# Altium schematic sheet Power.SchDoc
size A4
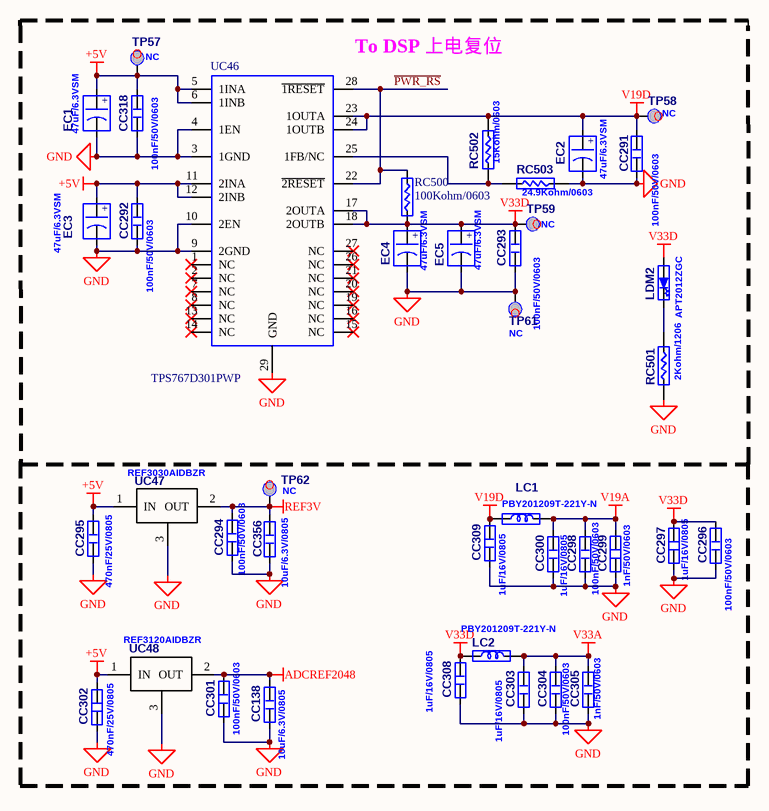
[diagram p0: Power.SchDoc]

## Parts
CC138  value 10uF/6.3V/0805  [CC2012-0805]  (hidden comment: 023-106330-0)
CC291  value 100nF/50V/0603  [CC1608-0603]  (hidden comment: 023-105220-0)
CC292  value 100nF/50V/0603  [CC1608-0603]  (hidden comment: 023-105220-0)
CC293  value 100nF/50V/0603  [CC1608-0603]  (hidden comment: 023-105220-0)
CC294  value 100nF/50V/0603  [CC1608-0603]  (hidden comment: 023-105220-0)
CC295  value 470nF/25V/0805  [CC2012-0805]  (hidden comment: 023-474250-0)
CC296  value 100nF/50V/0603  [CC1608-0603]  (hidden comment: 023-105220-0)
CC297  value 1uF/16V/0805  [CC2012-0805]  (hidden comment: 023-105330-0)
CC298  value 100nF/50V/0603  [CC1608-0603]  (hidden comment: 023-105220-0)
CC299  value 1nF/50V/0603  [CC1608-0603]  (hidden comment: 023-102220-0)
CC300  value 1uF/16V/0805  [CC2012-0805]  (hidden comment: 023-105330-0)
CC301  value 100nF/50V/0603  [CC1608-0603]  (hidden comment: 023-105220-0)
CC302  value 470nF/25V/0805  [CC2012-0805]  (hidden comment: 023-474250-0)
CC303  value 1uF/16V/0805  [CC2012-0805]  (hidden comment: 023-105330-0)
CC304  value 100nF/50V/0603  [CC1608-0603]  (hidden comment: 023-105220-0)
CC305  value 1nF/50V/0603  [CC1608-0603]  (hidden comment: 023-102220-0)
CC308  value 1uF/16V/0805  [CC2012-0805]  (hidden comment: 023-105330-0)
CC309  value 1uF/16V/0805  [CC2012-0805]  (hidden comment: 023-105330-0)
CC318  value 100nF/50V/0603  [CC1608-0603]  (hidden comment: 023-105220-0)
CC356  value 10uF/6.3V/0805  [CC2012-0805]  (hidden comment: 023-106330-0)
EC1  value 47uF/6.3VSM  [EC47UF/6.3VSM-5]  (hidden comment: 020-476003-0)
EC2  value 47uF/6.3VSM  [EC47UF/6.3VSM-5]  (hidden comment: 020-476003-0)
EC3  value 47uF/6.3VSM  [EC47UF/6.3VSM-5]  (hidden comment: 020-476003-0)
EC4  value 47uF/6.3VSM  [EC47UF/6.3VSM-5]  (hidden comment: 020-476003-0)
EC5  value 47uF/6.3VSM  [EC47UF/6.3VSM-5]  (hidden comment: 020-476003-0)
LC1  value PBY201209T-221Y-N  [L2012-0805]  (hidden comment: 080-200001-0)
LC2  value PBY201209T-221Y-N  [L2012-0805]  (hidden comment: 080-200001-0)
LDM2  value APT2012ZGC  [LED2012-0805SM]  (hidden comment: 060-011000-0)
RC500  value 100Kohm/0603  [R0603SM]  (hidden comment: 011-104020-0)
RC501  value 2Kohm/1206  [R3216-1206]  (hidden comment: 011-202050-0)
RC502  value 15Kohm/0603  [R1608-0603]  (hidden comment: 011-153020-0)
RC503  value 24.9Kohm/0603  [R1608-0603]  (hidden comment: 011-243020-0)
TP57  NC  [TEST-12]
TP58  NC  [TEST-12]
TP59  NC  [TEST-12]
TP61  NC  [TEST-12]
TP62  NC  [TEST-12]
UC46  value TPS767D301PWP  [TSSOP28-9.8X4.5-PD]  (hidden comment: 050-210100-0)
UC47  value REF3030AIDBZR  [SOT-23]  (hidden comment: 050-210111-0)
UC48  value REF3120AIDBZR  [SOT23-3]  (hidden comment: 050-210120-0)

## Blocks framed on the sheet
To DSP 上电复位: CC291-CC293 CC318 EC1-EC5 LDM2 RC500-RC503 TP57-TP59 TP61 UC46

## Nets
+5V: CC292.2 CC295.1 CC302.1 CC318.2 EC1.1 EC3.1 TP57.1 UC46.5(1INA) UC46.6(1INB) UC46.11(2INA) UC46.12(2INB) UC47.1(IN) UC48.1(IN)
ADCREF2048: CC138.2 CC301.1 UC48.2(OUT)
GND: CC138.1 CC291.2 CC292.1 CC293.2 CC294.2 CC295.2 CC296.2 CC297.1 CC298.2 CC299.2 CC300.2 CC301.2 CC302.2 CC303.1 CC304.2 CC305.1 CC308.1 CC309.1 CC318.1 CC356.1 EC1.2 EC2.2 EC3.2 EC4.2 EC5.2 RC501.1 RC503.1 TP61.1 UC46.3(1GND) UC46.4(1EN) UC46.9(2GND) UC46.10(2EN) UC46.29(GND) UC47.3 UC48.3
REF3V: CC294.1 CC356.2 TP62.1 UC47.2(OUT)
V19A: CC298.1 CC299.1 CC300.1 LC1.2
V19D: CC291.1 CC309.2 EC2.1 LC1.1 RC502.2 TP58.1 UC46.23(1OUTA) UC46.24(1OUTB)
V33A: CC303.2 CC304.1 CC305.2 LC2.2
V33D: CC293.1 CC296.1 CC297.2 CC308.2 EC4.1 EC5.1 LC2.1 LDM2.1 RC500.1 TP59.1 UC46.17(2OUTA) UC46.18(2OUTB)
~{PWR_RS}: RC500.2 UC46.22(~{2RESET}) UC46.28(~{1RESET})
NetLDM2_2: LDM2.2 RC501.2
NetRC502_1: RC502.1 RC503.2 UC46.25(1FB/NC)

Not connected (* = marked no-connect by the designer): UC46 1(NC)* 2(NC)* 7(NC)* 8(NC)* 13(NC)* 14(NC)* 15(NC)* 16(NC)* 19(NC)* 20(NC)* 21(NC)* 26(NC)* 27(NC)*

## Notes on the sheet
- (in symbol C47U/6.3VSM) +

## Library data of the parts
CC138 CC356 = C0603 SM: 10uF/6.3V/K/X7R/0805
CC291-CC294 CC296 CC298 CC301 CC304 CC318 = C0603 SM: 100nF/50V/J/X7R/0603
CC295 CC302 = C0805 SM: 470nF/25V/J/X7R/0805; Type: 贴片
CC297 CC300 CC303 CC308 CC309 = C0603 SM: 1uF/16V/K/X7R/0805
CC299 CC305 = C0603 SM: 1nF/50V/J/C0G/0603
EC1-EC5 = C47U/6.3VSM: 47uF/6.3V/Φ5*7/7000H/CW系列; Type: 贴片
LC1 LC2 = L0805SM: 220Ω±25%/100MHZ/20℃/0805
LDM2 = LD0805SM: 2.0*1.25*0.75mm/Green
RC500 = 011-104020-0 R0603SM: 100Kohm/1/10W/F/0603; Name of Material: 厚膜电阻; Vendor: RALEC/YAGEO; Factory model: RTT03 100KF TP/RC0603FR-07100KL; Assembly type: 贴片; PN: 011-104020-0
RC501 = R1206SM: 2Kohm/1/4W/F/1206
RC502 = R0603SM: 15Kohm/1/10W/F/0603
RC503 = R0603SM: 24.9Kohm/1/10W/F/0603
TP57-TP59 TP61 TP62 = 17K TPD: Type: 插件; Value: NC
UC46 = 050-210100-0 TSSOP28-9.8X4.5-PD: Low Dropout Regulator/HTSSOP-28; Name of Material: 集成电路; Vendor: TI; Assembly type: 贴片; PN: 050-210100-0; Factory model: TPS767D301PWP
UC47 = SOT-23SM: Voltage Reference/SOT23-3
UC48 = SOT23-3: Voltage Reference/SOT23-3